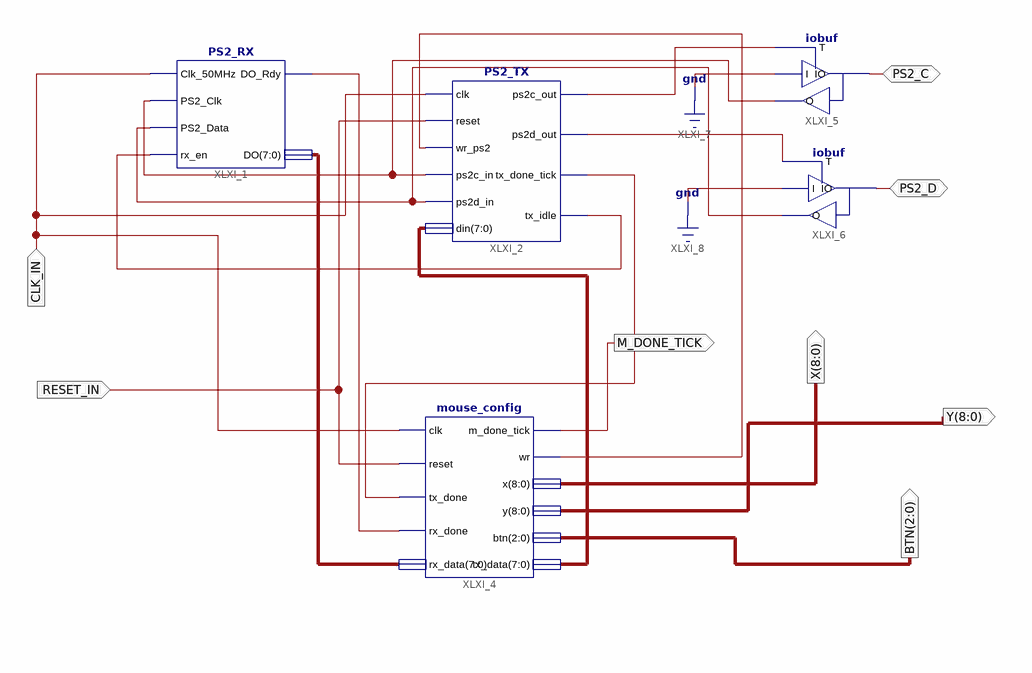
[diagram p0: schematic sheet 1]
// Xilinx ISE schematic test_mouse.sch (spartan3a) as structural Verilog: 5 symbols, 8 ports
module test_mouse (
  input  CLK_IN,
  input  RESET_IN,
  inout  PS2_C,
  inout  PS2_D,
  output M_DONE_TICK,
  output [8:0] X,
  output [2:0] BTN,
  output [8:0] Y
);

  wire XLXN_4, XLXN_7, XLXN_51, XLXN_52, XLXN_62, XLXN_64, XLXN_65, XLXN_66;
  wire [7:0] XLXN_11, XLXN_16;

  PS2_RX XLXI_1 (
    .Clk_50MHz(CLK_IN), .PS2_Clk(XLXN_66), .PS2_Data(XLXN_65), .rx_en(XLXN_64), .DO_Rdy(XLXN_7), .DO(XLXN_16));
  PS2_TX XLXI_2 (
    .clk(CLK_IN), .reset(RESET_IN), .wr_ps2(XLXN_4), .ps2c_in(XLXN_66), .ps2d_in(XLXN_65), .din(XLXN_11),
    .ps2c_out(XLXN_51), .ps2d_out(XLXN_52), .tx_done_tick(XLXN_62), .tx_idle(XLXN_64));
  mouse_config XLXI_4 (
    .clk(CLK_IN), .reset(RESET_IN), .tx_done(XLXN_62), .rx_done(XLXN_7), .rx_data(XLXN_16),
    .m_done_tick(M_DONE_TICK), .wr(XLXN_4), .x(X), .y(Y), .btn(BTN), .tx_data(XLXN_11));
  iobuf XLXI_5 (.I(1'b0), .IO(PS2_C), .O(XLXN_66), .T(XLXN_51));
  iobuf XLXI_6 (.I(1'b0), .IO(PS2_D), .O(XLXN_65), .T(XLXN_52));
endmodule
